# EAGLE design untitled (EAGLE 8.7.1)
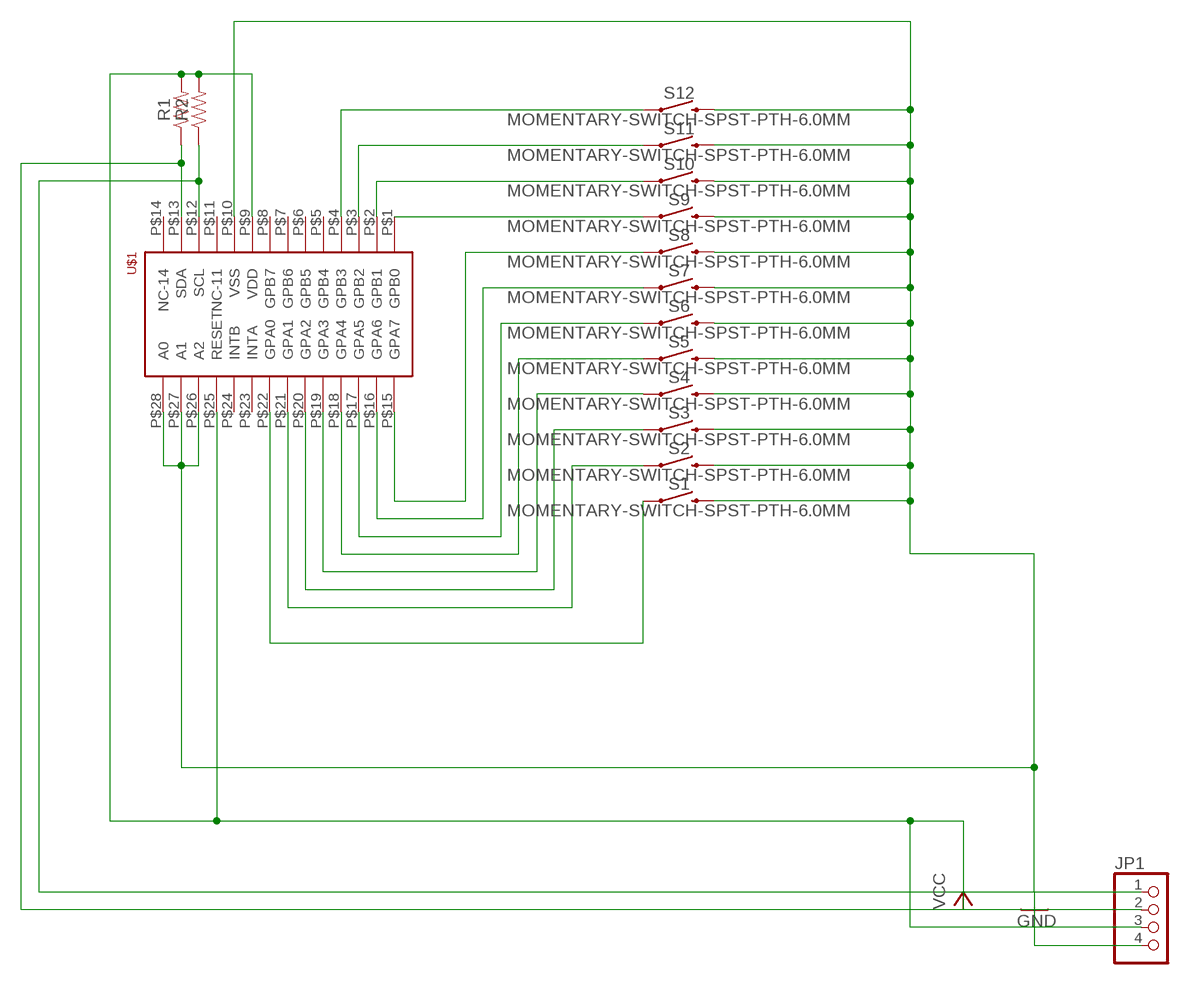
[diagram p0: schematic, sheet 1]

## Parts
JP1  PINHD-1X4  [1X04]
R1  RESISTORAXIAL-0.3  [AXIAL-0.3]
R2  RESISTORAXIAL-0.3  [AXIAL-0.3]
S1  MOMENTARY-SWITCH-SPST-PTH-6.0MM  [TACTILE_SWITCH_PTH_6.0MM]
S2  MOMENTARY-SWITCH-SPST-PTH-6.0MM  [TACTILE_SWITCH_PTH_6.0MM]
S3  MOMENTARY-SWITCH-SPST-PTH-6.0MM  [TACTILE_SWITCH_PTH_6.0MM]
S4  MOMENTARY-SWITCH-SPST-PTH-6.0MM  [TACTILE_SWITCH_PTH_6.0MM]
S5  MOMENTARY-SWITCH-SPST-PTH-6.0MM  [TACTILE_SWITCH_PTH_6.0MM]
S6  MOMENTARY-SWITCH-SPST-PTH-6.0MM  [TACTILE_SWITCH_PTH_6.0MM]
S7  MOMENTARY-SWITCH-SPST-PTH-6.0MM  [TACTILE_SWITCH_PTH_6.0MM]
S8  MOMENTARY-SWITCH-SPST-PTH-6.0MM  [TACTILE_SWITCH_PTH_6.0MM]
S9  MOMENTARY-SWITCH-SPST-PTH-6.0MM  [TACTILE_SWITCH_PTH_6.0MM]
S10  MOMENTARY-SWITCH-SPST-PTH-6.0MM  [TACTILE_SWITCH_PTH_6.0MM]
S11  MOMENTARY-SWITCH-SPST-PTH-6.0MM  [TACTILE_SWITCH_PTH_6.0MM]
S12  MOMENTARY-SWITCH-SPST-PTH-6.0MM  [TACTILE_SWITCH_PTH_6.0MM]
U$1  MCP23017-E/SP  [DIP28]

## Nets
GND: JP1.4 S1.3 S2.3 S3.3 S4.3 S5.3 S6.3 S7.3 S8.3 S9.3 S10.3 S11.3 S12.3 U$1.P$10(VSS) U$1.P$26(A2) U$1.P$27(A1) U$1.P$28(A0)
N$1: S1.1 U$1.P$22(GPA0)
N$2: S2.1 U$1.P$21(GPA1)
N$3: S3.1 U$1.P$20(GPA2)
N$4: S4.1 U$1.P$19(GPA3)
N$5: S5.1 U$1.P$18(GPA4)
N$6: S6.1 U$1.P$17(GPA5)
N$7: S7.1 U$1.P$16(GPA6)
N$8: S8.1 U$1.P$15(GPA7)
N$9: S9.1 U$1.P$1(GPB0)
N$10: S10.1 U$1.P$2(GPB1)
N$11: S11.1 U$1.P$3(GPB2)
N$12: S12.1 U$1.P$4(GPB3)
N$15: JP1.2 R1.P$1 U$1.P$13(SDA)
N$16: JP1.1 R2.P$1 U$1.P$12(SCL)
VCC: JP1.3 R1.P$2 R2.P$2 U$1.P$9(VDD) U$1.P$25(RESET)
Unconnected: U$1.P$5(GPB4) U$1.P$6(GPB5) U$1.P$7(GPB6) U$1.P$8(GPB7) U$1.P$11(NC-11) U$1.P$14(NC-14) U$1.P$23(INTA) U$1.P$24(INTB)

## Library data of the parts
JP1 = pinhead:PINHD-1X4: PIN HEADER; SPICEPREFIX: B
R1 R2 = SparkFun-Resistors:RESISTOR: Generic Resistor Package
S1-S12 = SparkFun-Switches:MOMENTARY-SWITCH-SPST: Momentary Switch (Pushbutton) - SPST Normally-open (NO) SPST momentary switches (buttons, pushbuttons). Variants PTH-12MM - 12mm square, through-hole Momentary Pushbutton Switch - 12mm Square <https://www.sparkfun.com/products/9190> (COM-09190) PTH-6.0MM, PTH-6.0MM-KIT - 6.0mm square, through-hole Mini Pushbutton Switch <https://www.sparkfun.com/products/97> (COM-00097) KIT package intended for soldering kit's - only one side of pads' copper is exposed. PTH-RIGHT-ANGLE-KIT - Right-angle, through-hole Right Angle Tactile Button <https://www.sparkfun.com/products/10791> - Used on SparkFun BigTime Watch Kit <https://www.sparkfun.com/products/11734> SMD-12MM - 12mm square, surface-mount Tactile Button - SMD (12mm) <https://www.sparkfun.com/products/12993> (COM-12993) Used on SparkFun PicoBoard <https://www.sparkfun.com/products/11888> SMD-4.5MM - 4.5mm Square Trackball Switch Used on SparkFun Blackberry Trackballer Breakout <https://www.sparkfun.com/products/13169> SMD-4.6MMX2.8MM - 4.60mm x 2.80mm, surface mount Used on SparkFun SAMD21 Mini Breakout <https://www.sparkfun.com/products/13664> SMD-5.2MM, SMD-5.2-REDUNDANT - 5.2mm square, surface-mount Mini Pushbutton Switch - SMD <https://www.sparkfun.com/products/8720> (COM-08720) Used on Arduino Pro Mini <https://www.sparkfun.com/products/11114> REDUNDANT package connects both switch circuits together SMD-6.0X3.5MM - 6.0 x 3.5mm, surface mount Momentary Reset Switch SMD <https://www.sparkfun.com/products/8229> (COM-08229) SMD-6.2MM-TALL - 6.2mm square, surface mount Tactile Button - SMD (6mm) <https://www.sparkfun.com/products/12992> Used on SparkFun Digital Sandbox <https://www.sparkfun.com/products/12651> SMD-RIGHT-ANGLE - Right-angle, surface mount Used on SparkFun Block for Intel® Edison - Arduino <https://www.sparkfun.com/products/13036>; PROD_ID: SWCH-08441; SF_SKU: COM-00097
U$1 = IO-Expanders-2:MCP23017-E/SP: MCP23017 16 pin IO Expander using I2C bus; MCP23017-ESP: DIP

## Board
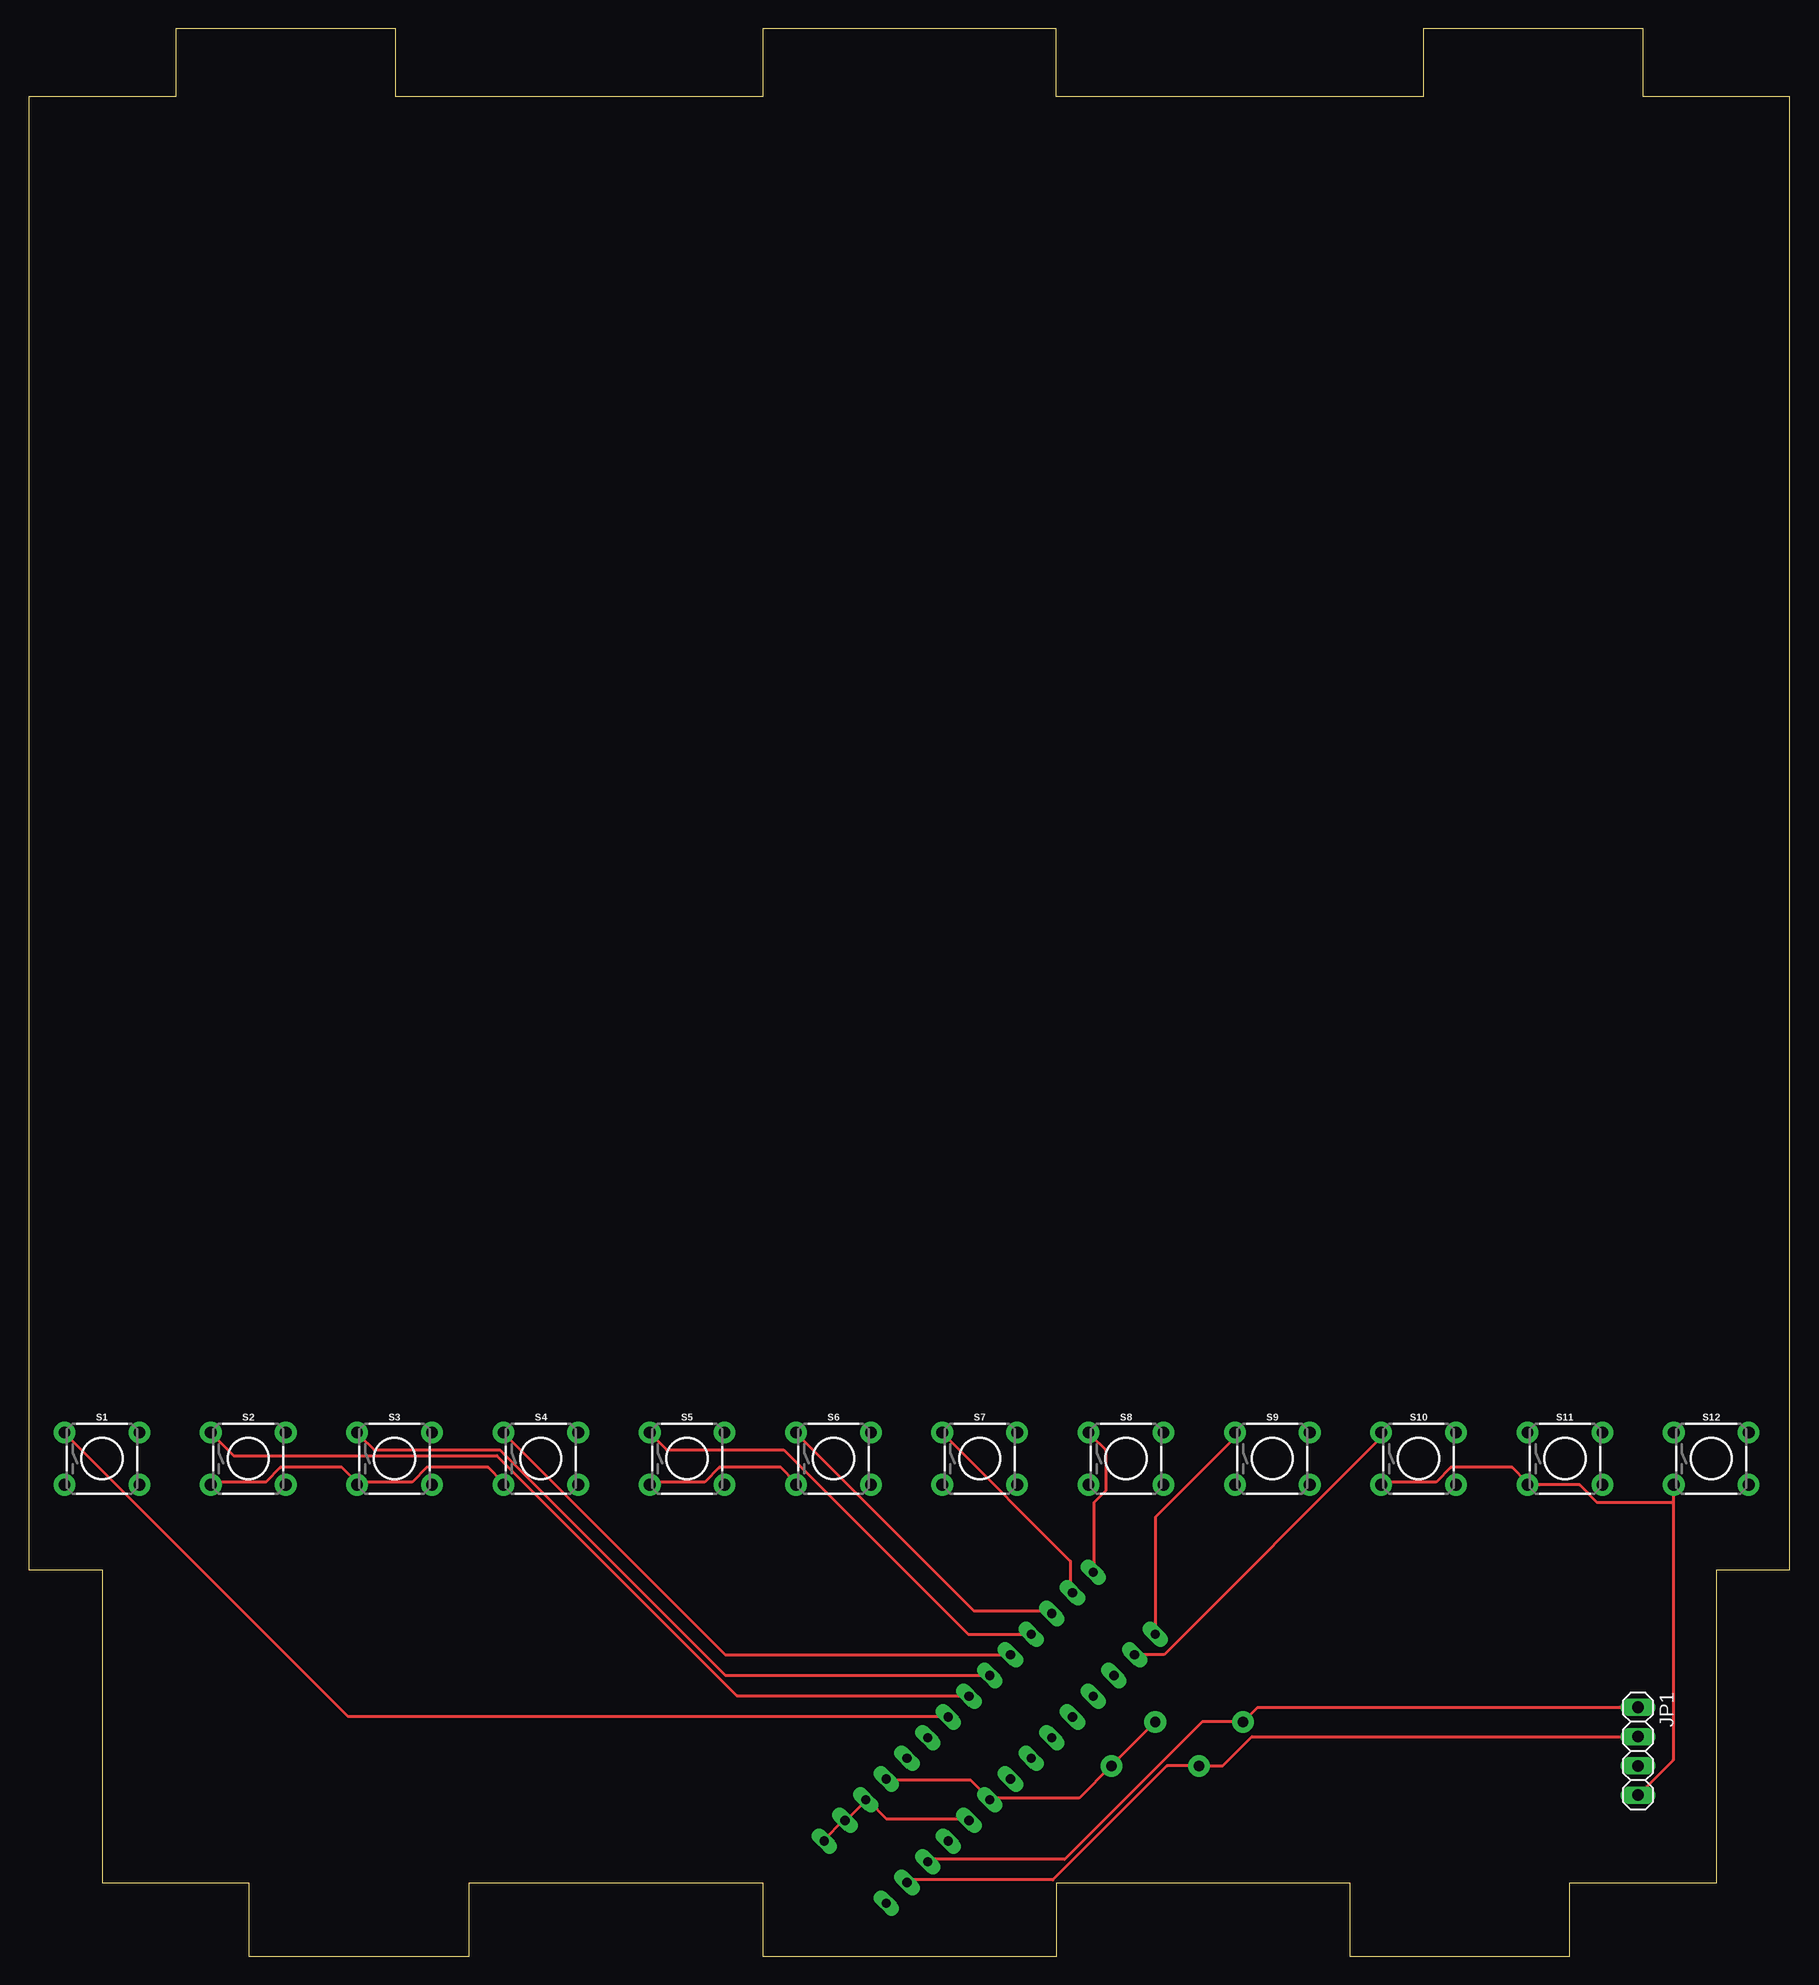
[diagram p1: board, top side]
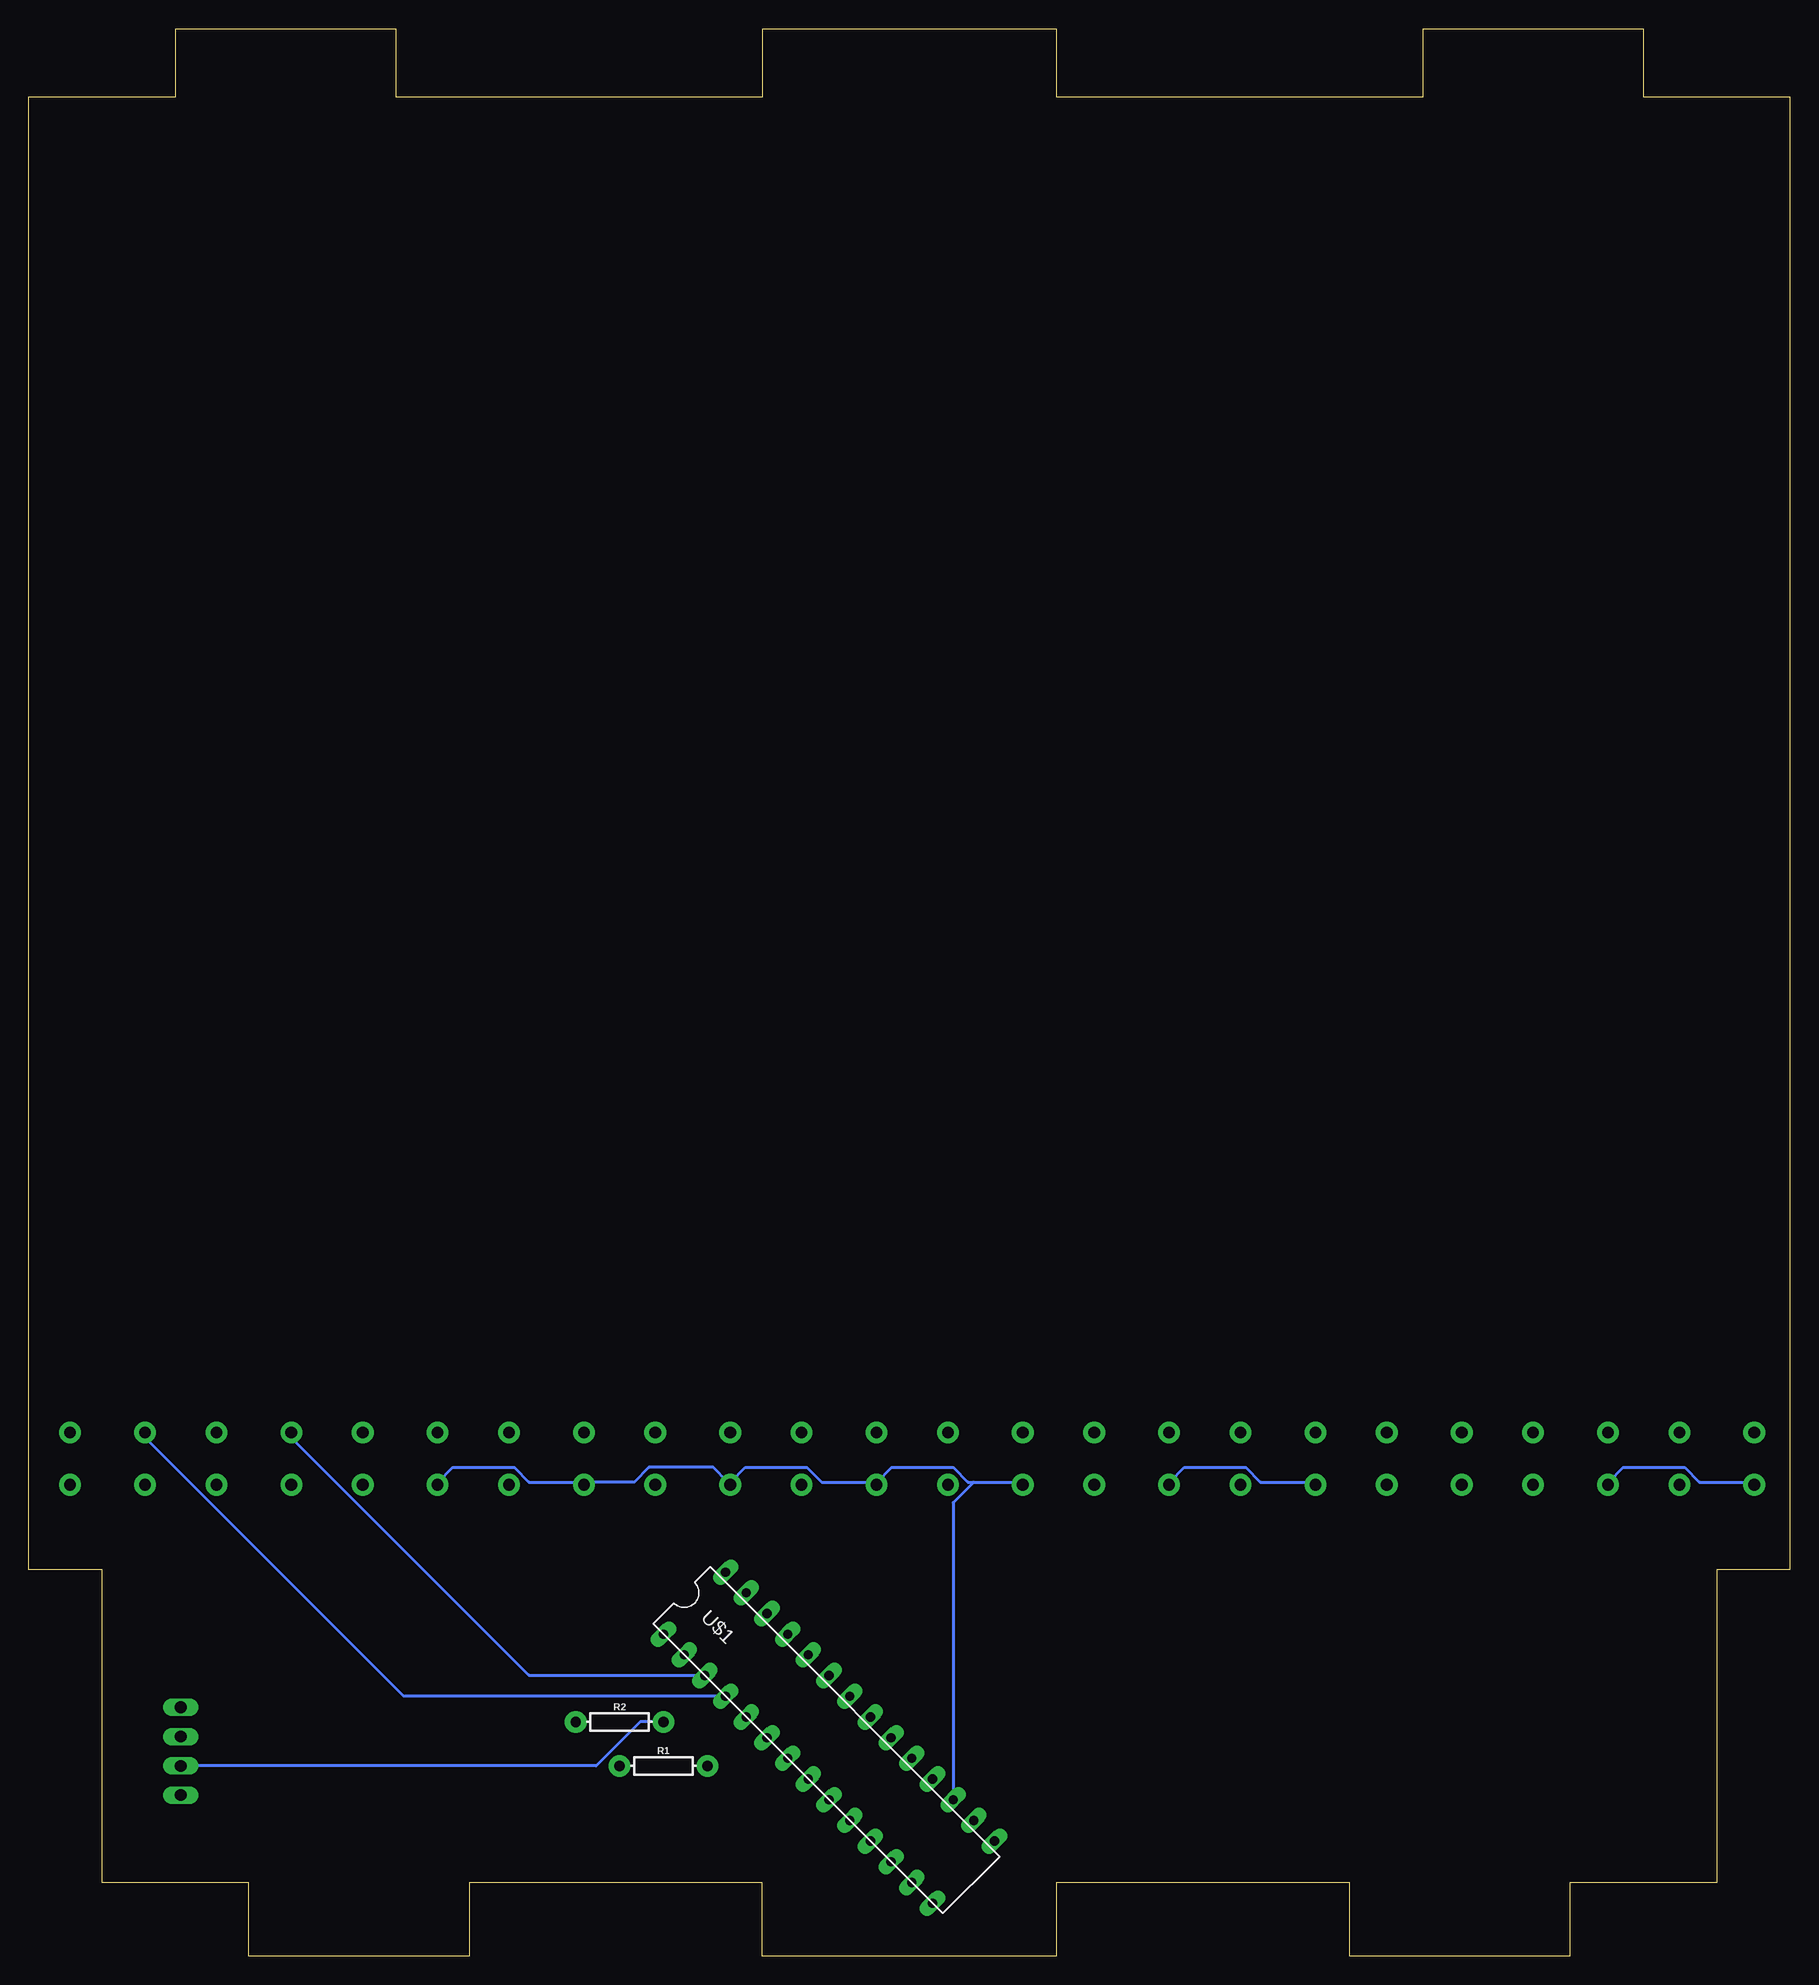
[diagram p2: board, bottom side, seen from below]

Size 152.89 x 167.31 mm. Coordinates in mm from the lower left corner, seen from the top.
Outline: 12.74,167.3 12.74,161.41 0,161.41 0,33.55 6.37,33.55 6.37,6.37 19.11,6.37 19.11,0 38.22,0 38.22,6.37 63.7,6.37 63.7,0 89.22,0 89.22,6.37 114.67,6.37 114.67,0 133.78,0 133.78,6.37 146.52,6.37 146.52,33.55 152.89,33.55 152.89,161.41 140.15,161.41 140.15,167.3 121.04,167.3 121.04,161.41 89.19,161.41 89.19,167.3 63.7,167.3 63.7,161.41 31.85,161.41 31.85,167.3 12.74,167.3
Copper layers (1*16): Top 0.035mm / dielectric 1.5mm / Bottom 0.035mm
Design rules "steve": minimum track width 10mil, minimum drill 24mil, track to track 10mil, track to pad 10mil, pad to pad 10mil, via to via 10mil, smd to smd 10mil, copper to edge 10mil, drill to drill 10mil, minimum pad ring 10mil, minimum via ring 10mil, stop-mask expansion 4mil, vias tented up to drill 0mil, thermal gap 10mil

### Footprints (pad centres in the part's own frame; a part is rotated, then mirrored left to right if it is on the bottom)
1X04 = drill 1.016 long: 1 -3.81,0; 2 -1.27,0; 3 1.27,0; 4 3.81,0
AXIAL-0.3 = drill 0.9 pad 1.88: P$1 -3.81,0; P$2 3.81,0
TACTILE_SWITCH_PTH_6.0MM = drill 1.016 pad 1.88: 1 -3.251,2.261; 2 3.251,2.261; 3 -3.251,-2.261; 4 3.251,-2.261
DIP28 = drill 0.8 long: P$1 0,0; P$2 2.54,0; P$3 5.08,0; P$4 7.62,0; P$5 10.16,0; P$6 12.7,0; P$7 15.24,0; P$8 17.78,0; P$9 20.32,0; P$10 22.86,0; P$11 25.4,0; P$12 27.94,0; P$13 30.48,0; P$14 33.02,0; P$15 0,7.62; P$16 2.54,7.62; P$17 5.08,7.62; P$18 7.62,7.62; P$19 10.16,7.62; P$20 12.7,7.62; P$21 15.24,7.62; P$22 17.78,7.62; P$23 20.32,7.62; P$24 22.86,7.62; P$25 25.4,7.62; P$26 27.94,7.62; P$27 30.48,7.62; P$28 33.02,7.62

### Placement (x,y rotation side)
JP1  139.7,17.78 270 top
R1  97.79,16.51 0 bottom
R2  101.6,20.32 0 bottom
S1  6.35,43.18 0 top
S2  19.05,43.18 0 top
S3  31.75,43.18 0 top
S4  44.45,43.18 0 top
S5  57.15,43.18 0 top
S6  69.85,43.18 0 top
S7  82.55,43.18 0 top
S8  95.25,43.18 0 top
S9  107.95,43.18 0 top
S10  120.65,43.18 0 top
S11  133.35,43.18 0 top
S12  146.05,43.18 0 top
U$1  97.79,27.94 315 bottom

### Tracks (layer width: path | path; a pad name or v marks a point on that pad's centre or on a via)
GND
  Top 0.254: JP1.4 142.75,17.02 142.75,39.37 | 142.75,39.37 142.75,40.89 S12.3 | 142.75,39.37 136.14,39.37 134.62,40.89 130.3,40.89 S11.3 130.05,41.15 128.78,42.42 123.44,42.42 122.17,41.15 117.6,41.15 S10.3 | S4.3 41.15,41.15 39.88,42.42 34.54,42.42 33.27,41.15 28.7,41.15 S3.3 28.45,41.15 27.18,42.42 21.84,42.42 20.57,41.15 16,41.15 S2.3 | U$1.P$28 69.09,10.16 70.61,11.68 U$1.P$27 70.87,11.68 72.64,13.46 U$1.P$26 72.9,13.46 74.42,11.94 81.53,11.94 U$1.P$10 | S5.3 54.1,41.15 58.67,41.15 59.94,42.42 65.28,42.42 66.55,41.15 S6.3
  Bottom 0.254: S10.3 117.35,41.15 116.08,42.42 110.74,42.42 109.47,41.15 104.9,41.15 S9.3 104.65,41.15 100.33,41.15 99.06,42.42 93.47,42.42 92.2,41.15 S8.3 91.95,41.15 90.68,42.42 85.34,42.42 84.07,41.15 79.5,41.15 S7.3 79.25,41.15 77.98,42.42 72.64,42.42 71.37,41.15 70.87,41.15 | S1.3 3.3,41.15 7.87,41.15 9.14,42.42 14.48,42.42 15.75,41.15 S2.3 | 70.87,41.15 66.8,41.15 S6.3 | 70.87,41.15 72.64,39.37 72.64,13.72 U$1.P$26 | S4.3 41.4,41.15 45.97,41.15 47.24,42.42 52.58,42.42 53.85,41.15 S5.3
N$1
  Top 0.254: U$1.P$22 79.76,20.83 27.69,20.83 3.3,45.21 S1.1
N$2
  Top 0.254: U$1.P$21 81.53,22.61 61.47,22.61 40.64,43.43 17.78,43.43 16,45.21 S2.1
N$3
  Top 0.254: U$1.P$20 83.31,24.38 60.45,24.38 40.89,43.94 29.97,43.94 28.7,45.21 S3.1
N$4
  Top 0.254: U$1.P$19 85.09,26.16 60.45,26.16 41.4,45.21 S4.1
N$5
  Top 0.254: U$1.P$18 81.53,27.94 65.53,43.94 55.37,43.94 54.1,45.21 S5.1
N$6
  Top 0.254: U$1.P$17 88.65,29.97 82.04,29.97 66.8,45.21 S6.1
N$7
  Top 0.254: U$1.P$16 90.42,31.75 90.42,34.29 79.5,45.21 S7.1
N$8
  Top 0.254: U$1.P$15 92.46,33.53 92.46,39.37 93.47,40.39 93.47,43.94 92.2,45.21 S8.1
N$9
  Top 0.254: U$1.P$1 97.79,38.1 104.9,45.21 S9.1
N$10
  Top 0.254: U$1.P$2 96.01,26.16 98.55,26.16 117.6,45.21 S10.1
N$11
  Bottom 0.254: U$1.P$3 94.23,24.38 109.47,24.38 130.3,45.21 S11.1
N$12
  Bottom 0.254: U$1.P$4 92.46,22.61 120.4,22.61 143,45.21 S12.1
N$15
  Top 0.254: U$1.P$13 76.45,6.6 88.9,6.6 98.81,16.51 R1.P$1 103.63,16.51 106.17,19.05 JP1.2
N$16
  Top 0.254: U$1.P$12 78.23,8.38 89.92,8.38 101.85,20.32 R2.P$1 106.68,21.59 JP1.1
VCC
  Top 0.254: U$1.P$25 74.68,15.24 81.79,15.24 83.31,13.72 U$1.P$9 83.57,13.72 91.19,13.72 R1.P$2 R2.P$2
  Bottom 0.254: JP1.3 103.63,16.51 99.82,20.32 R2.P$2